# EAGLE board STM32-E407_Rev_E (EAGLE 4.16), part 1 of 2
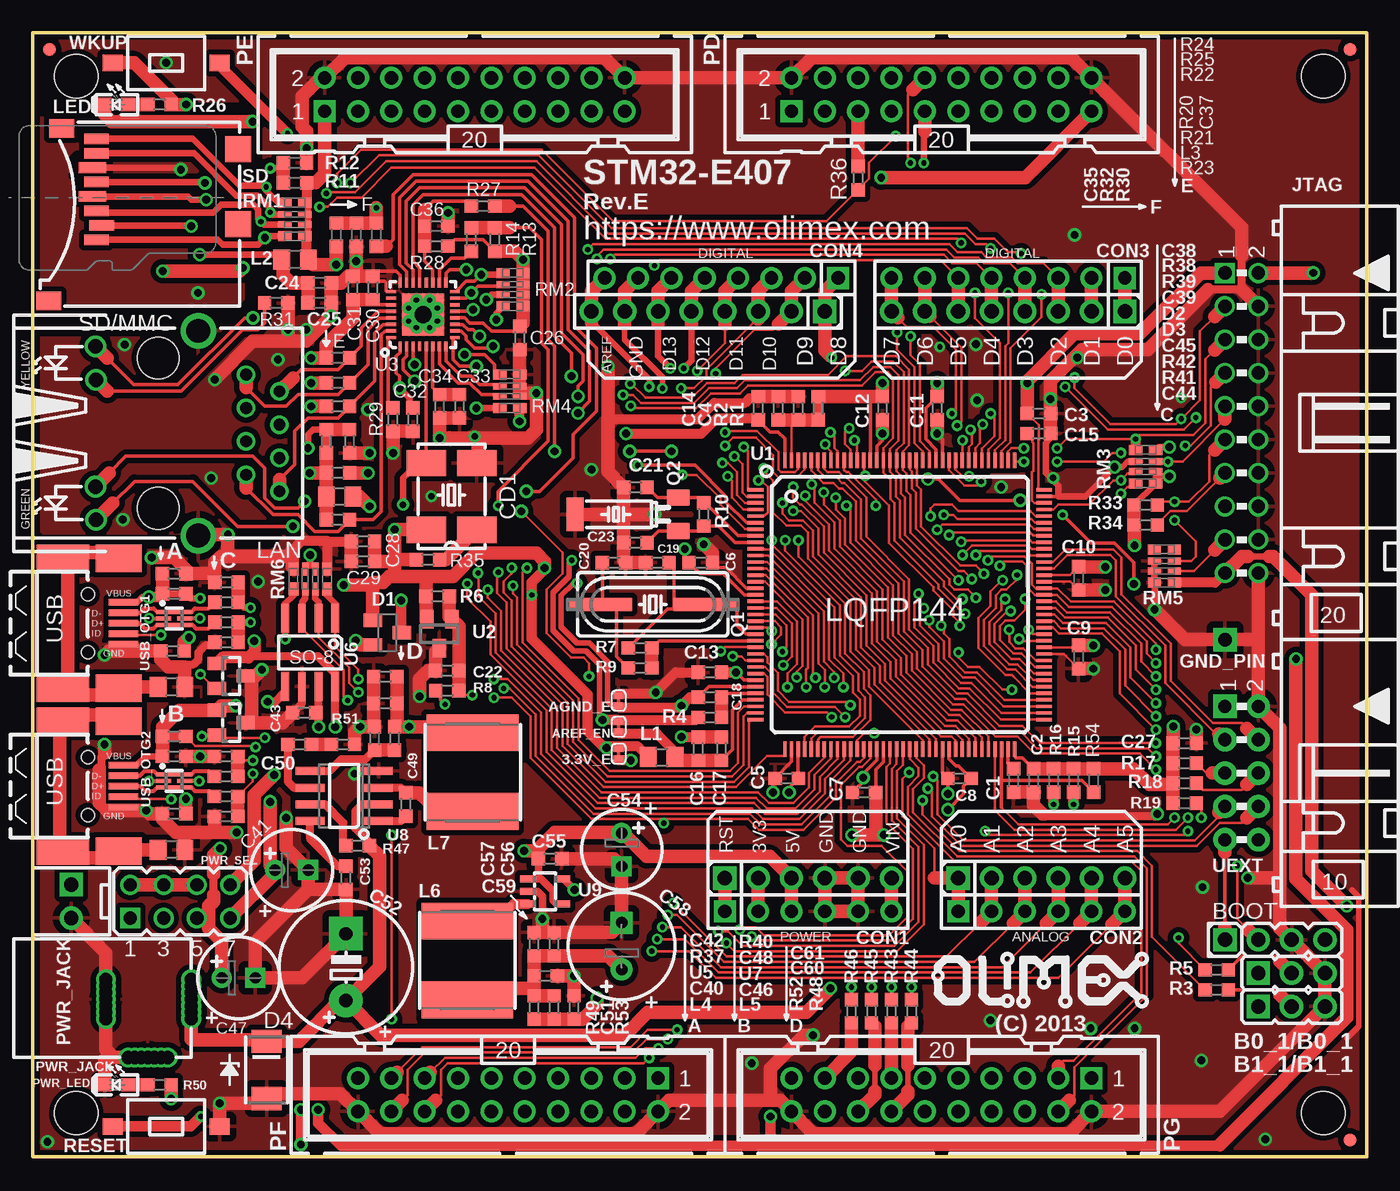
[diagram p2: board, top side]
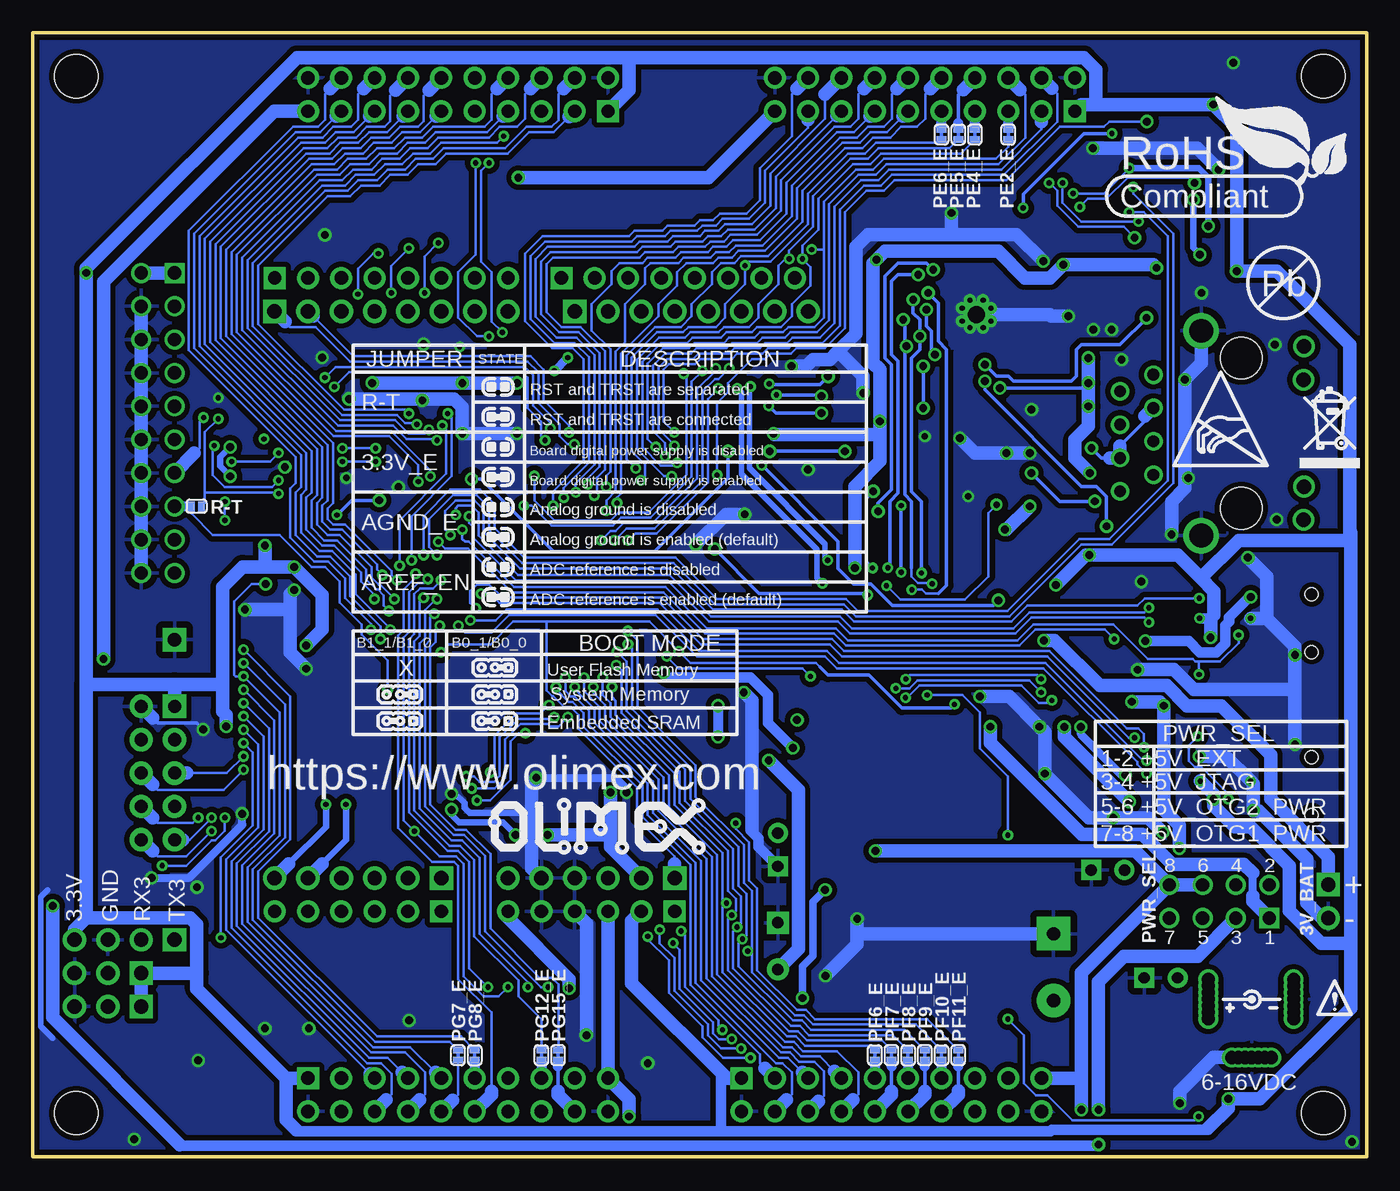
[diagram p3: board, bottom side, seen from below]

Size 101.6 x 85.6 mm. Coordinates in mm from the lower left corner, seen from the top.
Outline: 0,0 101.6,0 101.6,85.6 0,85.6 0,0
Copper layers (1+16): Top 0.035mm / dielectric 1.5mm / Bottom 0.035mm
Design rules "default": minimum track width 8mil, minimum drill 0.4mm, track to track 7.5mil, track to pad 7.5mil, pad to pad 7.5mil, via to via 7.5mil, smd to smd 1mil, copper to edge 10mil, drill to drill 8mil, minimum pad ring 10mil, minimum via ring 8mil, stop-mask expansion 4mil, vias tented up to drill 25mil, thermal gap 20mil
Net classes: 2 thin: width 0.025 mm, drill 0.025 mm; 3 gsm_pwr: width 0.914 mm, clearance 0.787 mm
Holes 3.3 mm at 3.3,82.3 98.3,82.3 98.3,3.3 3.3,3.3
tRestrict: 19 lines

## Footprints (pad centres in the part's own frame; a part is rotated, then mirrored left to right if it is on the bottom)
SJ_1_SMALLER_CLOSE = smd 0.508 x 0.762: 1 -0.381,0; 2 0.381,0
CON2.54MM-2-0 = drill 1.092 pad 1.778 square: 1 -1.27,0 | drill 1.092 pad 1.778 round: 2 1.27,0
JP2 = drill 1.1 pad 1.778 square: 1 -2.54,0 | drill 1.1 pad 1.778 round: 2 0,0; 3 2.54,0
HN1X4 = drill 1.1 pad 1.778 square: 1 -3.81,0 | drill 1.1 pad 1.778 round: 2 -1.27,0; 3 1.27,0; 4 3.81,0
C0603_DWS = smd 1.016 x 1.016: 1 -0.889,0; 2 0.889,0
E2,5-6,3 = drill 0.864 pad 1.524 round: + -1.27,0 | drill 0.864 pad 1.524 square: - 1.27,0
E5-10,5 = drill 1.016 pad 2.54 round: + -2.54,0 | drill 1.016 pad 2.54 square: - 2.54,0
E2,5-6 = drill 0.864 pad 1.524 round: + -1.27,0 | drill 0.864 pad 1.524 square: - 1.27,0
E3,5-8 = drill 0.864 pad 1.676 round: + -1.778,0 | drill 0.864 pad 1.676 square: - 1.778,0
7X5MM_CLOCK_DRIVER = smd 2 x 3: 1 -2.54,-1.941; 2 2.54,-1.941; 3 2.54,1.901; 4 -2.54,1.901
PN1X6 = drill 1.1 pad 1.778 square: 1 -6.35,0 | drill 1.1 pad 1.778 round: 2 -3.81,0; 3 -1.27,0; 4 1.27,0; 5 3.81,0; 6 6.35,0
PN1X8 = drill 1.1 pad 1.778 square: 1 -8.89,0 | drill 1.1 pad 1.778 round: 2 -6.35,0; 3 -3.81,0; 4 -1.27,0; 5 1.27,0; 6 3.81,0; 7 6.35,0; 8 8.89,0
SOT23C = smd 1 x 1.4: 1 -0.95,-1.1; 2 0.95,-1.1; 3 0,1.1
SOT-23 = smd 1 x 1.4: 1 -0.95,-1.1; 2 0.95,-1.1; 3 0,1.1
DO214AA = smd 1.778 x 2.286: A 2.177,0; C -2.177,0
TEST_PAD40/70/SQUARE = drill 1.016 pad 1.778 square: P$1 0,0
BH20R = drill 1.016 square: 1 -11.43,-1.27 | drill 1.016 round: 2 -11.43,1.27; 3 -8.89,-1.27; 4 -8.89,1.27; 5 -6.35,-1.27; 6 -6.35,1.27; 7 -3.81,-1.27; 8 -3.81,1.27; 9 -1.27,-1.27; 10 -1.27,1.27; 11 1.27,-1.27; 12 1.27,1.27; 13 3.81,-1.27; 14 3.81,1.27; 15 6.35,-1.27; 16 6.35,1.27; 17 8.89,-1.27; 18 8.89,1.27; 19 11.43,-1.27; 20 11.43,1.27
L0805_5MIL_DWS = smd 1.27 x 1.524: 1 -1.016,0; 2 1.016,0
L7078 = smd 2.8 x 7: 1 -3,0; 2 3,0
RJLBC-060TC1 = drill 0.9 round: 1 -4.455,6.7; 2 -3.185,9.24; 3 -1.915,6.7; 4 -0.645,9.24; 5 0.625,6.7; 6 1.895,9.24; 7 3.165,6.7; 8 4.435,9.24 | drill 1.1 round: AG 4.07,-4.773; AY -6.61,-4.773; KG 6.61,-4.748; KY -4.07,-4.748 | drill 1.8 round: GND1 -7.8,3.05; GND2 7.8,3.05 | hole 3.2: -5.715,0; 5.715,0
LED-0603 = smd 1.016 x 1.016: A 0.889,0; C -0.889,0
ML20-MALE = drill 1.016 pad 1.676 square: 1 -11.43,-1.27 | drill 1.016 pad 1.676 round: 2 -11.43,1.27; 3 -8.89,-1.27; 4 -8.89,1.27; 5 -6.35,-1.27; 6 -6.35,1.27; 7 -3.81,-1.27; 8 -3.81,1.27; 9 -1.27,-1.27; 10 -1.27,1.27; 11 1.27,-1.27; 12 1.27,1.27; 13 3.81,-1.27; 14 3.81,1.27; 15 6.35,-1.27; 16 6.35,1.27; 17 8.89,-1.27; 18 8.89,1.27; 19 11.43,-1.27; 20 11.43,1.27
PWR_JACK_UNI_MILLING = drill 1 round: + 0,4.75; +1 0,5.25; +2 0,5.75; +3 0,6.25; +4 0,4.25; +5 0,3.75; +6 0,3.25; - -6.5,4.75; -1 -6.5,5.25; -2 -6.5,5.75; -3 -6.5,4.25; -4 -6.5,3.75; -5 -6.5,6.25; -6 -6.5,3.25; -- -3.3,0.3; --1 -3.8,0.3; --2 -4.3,0.3; --3 -4.8,0.3; --4 -2.8,0.3; --5 -2.3,0.3; --6 -1.8,0.3
JP4Q_2 = drill 1 pad 1.524 square: 1 -3.81,-1.27 | drill 1 pad 1.524 round: 2 -3.81,1.27; 3 -1.27,-1.27; 4 -1.27,1.27; 5 1.27,-1.27; 6 1.27,1.27; 7 3.81,-1.27; 8 3.81,1.27
HC49/SMD2_THIN = smd 5 x 1: 1 -4.064,0; 2 4.064,0
TC26H_3_REPAIR_SMD = smd 1.27 x 1.778: 1 -1.27,0; 2 1.27,0 | smd 2.54 x 1.27: GND 0,7.874
0603_0R = smd 1.016 x 1.016: 1 -0.889,0; 2 0.889,0
R0603_5MIL_DWS = smd 1.016 x 1.016: 1 -0.889,0; 2 0.889,0
SJ_1_SMALLER = smd 0.508 x 0.762: 1 -0.381,0; 2 0.381,0
WS-TAKT_6X3.5_SMD_NOCREAM = smd 1.27 x 1.524: P$1 0,4.064; P$2 0,-4.064
R_MATRIX_4 = smd 1.016 x 0.762: 1.1 -0.762,1.27; 1.2 0.762,1.27; 4.1 -0.762,-1.27; 4.2 0.762,-1.27 | smd 1.016 x 0.508: 2.1 -0.762,0.381; 2.2 0.762,0.381; 3.1 -0.762,-0.381; 3.2 0.762,-0.381
TFR/C-MEM-CON = smd 0.8 x 1.9: 1 -3.2,10.9; 2 -2.1,10.5; 3 -1,10.9; 5 1.2,10.9; 7 3.4,10.9; 8 4.5,10.9 | smd 0.8 x 2.1: 4 0.1,11.2; 6 2.3,11.2 | smd 2 x 2: 9 3.7,0.1; 10 -2,0.1 | smd 1.4 x 1.9: 11 5.3,13.55; 12 -7.85,14.55
LQFP144 = smd 1.2 x 0.254: 1 -11,8.75; 2 -11,8.25; 3 -11,7.75; 4 -11,7.25; 5 -11,6.75; 6 -11,6.25; 7 -11,5.75; 8 -11,5.25; 9 -11,4.75; 10 -11,4.25; 11 -11,3.75; 12 -11,3.25; 13 -11,2.75; 14 -11,2.25; 15 -11,1.75; 16 -11,1.25; 17 -11,0.75; 18 -11,0.25; 19 -11,-0.25; 20 -11,-0.75; 21 -11,-1.25; 22 -11,-1.75; 23 -11,-2.25; 24 -11,-2.75; 25 -11,-3.25; 26 -11,-3.75; 27 -11,-4.25; 28 -11,-4.75; 29 -11,-5.25; 30 -11,-5.75; 31 -11,-6.25; 32 -11,-6.75; 33 -11,-7.25; 34 -11,-7.75; 35 -11,-8.25; 36 -11,-8.75; 73 11,-8.75; 74 11,-8.25; 75 11,-7.75; 76 11,-7.25; 77 11,-6.75; 78 11,-6.25; 79 11,-5.75; 80 11,-5.25; 81 11,-4.75; 82 11,-4.25; 83 11,-3.75; 84 11,-3.25; 85 11,-2.75; 86 11,-2.25; 87 11,-1.75; 88 11,-1.25; 89 11,-0.75; 90 11,-0.25; 91 11,0.25; 92 11,0.75; 93 11,1.25; 94 11,1.75; 95 11,2.25; 96 11,2.75; 97 11,3.25; 98 11,3.75; 99 11,4.25; 100 11,4.75; 101 11,5.25; 102 11,5.75; 103 11,6.25; 104 11,6.75; 105 11,7.25; 106 11,7.75; 107 11,8.25; 108 11,8.75 | smd 0.254 x 1.2: 37 -8.75,-11; 38 -8.25,-11; 39 -7.75,-11; 40 -7.25,-11; 41 -6.75,-11; 42 -6.25,-11; 43 -5.75,-11; 44 -5.25,-11; 45 -4.75,-11; 46 -4.25,-11; 47 -3.75,-11; 48 -3.25,-11; 49 -2.75,-11; 50 -2.25,-11; 51 -1.75,-11; 52 -1.25,-11; 53 -0.75,-11; 54 -0.25,-11; 55 0.25,-11; 56 0.75,-11; 57 1.25,-11; 58 1.75,-11; 59 2.25,-11; 60 2.75,-11; 61 3.25,-11; 62 3.75,-11; 63 4.25,-11; 64 4.75,-11; 65 5.25,-11; 66 5.75,-11; 67 6.25,-11; 68 6.75,-11; 69 7.25,-11; 70 7.75,-11; 71 8.25,-11; 72 8.75,-11; 109 8.75,11; 110 8.25,11; 111 7.75,11; 112 7.25,11; 113 6.75,11; 114 6.25,11; 115 5.75,11; 116 5.25,11; 117 4.75,11; 118 4.25,11; 119 3.75,11; 120 3.25,11; 121 2.75,11; 122 2.25,11; 123 1.75,11; 124 1.25,11; 125 0.75,11; 126 0.25,11; 127 -0.25,11; 128 -0.75,11; 129 -1.25,11; 130 -1.75,11; 131 -2.25,11; 132 -2.75,11; 133 -3.25,11; 134 -3.75,11; 135 -4.25,11; 136 -4.75,11; 137 -5.25,11; 138 -5.75,11; 139 -6.25,11; 140 -6.75,11; 141 -7.25,11; 142 -7.75,11; 143 -8.25,11; 144 -8.75,11
SOT23 = smd 1 x 1.4: 1 -0.95,-1.1; 2 0.95,-1.1; 3 0,1.1
QFN-32(DRILLS) = smd 0.25 x 0.75: 1 -1.75,-2.425; 2 -1.25,-2.425; 3 -0.75,-2.425; 4 -0.25,-2.425; 5 0.25,-2.425; 6 0.75,-2.425; 7 1.25,-2.425; 8 1.75,-2.425; 17 1.75,2.425; 18 1.25,2.425; 19 0.75,2.425; 20 0.25,2.425; 21 -0.25,2.425; 22 -0.75,2.425; 23 -1.25,2.425; 24 -1.75,2.425 | smd 0.75 x 0.25: 9 2.425,-1.75; 10 2.425,-1.25; 11 2.425,-0.75; 12 2.425,-0.25; 13 2.425,0.25; 14 2.425,0.75; 15 2.425,1.25; 16 2.425,1.75; 25 -2.425,1.75; 26 -2.425,1.25; 27 -2.425,0.75; 28 -2.425,0.25; 29 -2.425,-0.25; 30 -2.425,-0.75; 31 -2.425,-1.25; 32 -2.425,-1.75 | drill 1.3 round: EP1 0,0 | drill 0.4 round: EP2 -0.5,1.1; EP3 0.5,1.1; EP4 1.1,0.5; EP5 1.1,-0.5; EP6 0.5,-1; EP7 -0.5,-1; EP8 -1.1,-0.5; EP9 -1.1,0.5 | smd 3.2 x 3.2: EXP_PAD 0,0
ARDUINO_SHIELD_PLATFORM_WITHOUT_DIMENSION = drill 1.016 pad 1.676 round: 3V3 22.86,2.54; 5V 25.4,2.54; A1 40.64,2.54; A2 43.18,2.54; A3 45.72,2.54; A4 48.26,2.54; A5 50.8,2.54; AREF 11.176,50.8; D1 48.26,50.8; D2 45.72,50.8; D3 43.18,50.8; D4 40.64,50.8; D5 38.1,50.8; D6 35.56,50.8; D7 33.02,50.8; D9 26.416,50.8; D10 23.876,50.8; D11 21.336,50.8; D12 18.796,50.8; D13 16.256,50.8; GND 27.94,2.54; GND@1 30.48,2.54; GND@2 13.716,50.8; VIN 33.02,2.54 | drill 1.016 pad 1.676 square: A0 38.1,2.54; D0 50.8,50.8; D8 28.956,50.8; RST 20.32,2.54
USBLC6-2P6 = smd 0.3 x 1.46: 1 -0.5,-0.65; 3 0.5,-0.65; 4 0.5,0.65; 6 -0.5,0.65 | smd 0.3 x 1.16: 2 0,-0.8; 5 0,0.8
SO-8 = smd 0.6 x 2.2: 1 -1.905,-2.6; 2 -0.635,-2.6; 3 0.635,-2.6; 4 1.905,-2.6; 5 1.905,2.6; 6 0.635,2.6; 7 -0.635,2.6; 8 -1.905,2.6
SOIC8 = smd 0.6 x 2.2: 1 -1.905,-2.6; 2 -0.635,-2.6; 3 0.635,-2.6; 4 1.905,-2.6; 5 1.905,2.6; 6 0.635,2.6; 7 -0.635,2.6; 8 -1.905,2.6
SOT23-5 = smd 0.55 x 1.2: 1 -0.95,-1.3; 2 0,-1.3; 3 0.95,-1.3; 4 0.95,1.3; 5 -0.95,1.3
FIDUCIAL-1X2 = smd 1 x 1: 1 0,0
BH10R = drill 1 pad 1.778 square: 1 -5.08,-1.27 | drill 1 pad 1.778 round: 2 -5.08,1.27; 3 -2.54,-1.27; 4 -2.54,1.27; 5 0,-1.27; 6 0,1.27; 7 2.54,-1.27; 8 2.54,1.27; 9 5.08,-1.27; 10 5.08,1.27
USB_MINI_9PIN = smd 2.25 x 0.5: D+ 2.706,0; D- 2.706,0.8; GND 2.706,-1.6; ID 2.706,-0.8; VBUS 2.706,1.6 | smd 4 x 2.1: GND1 -1.9,4.95; GND3 -1.9,-4.95 | smd 3.5 x 2.1: GND2 2.35,4.95; GND4 2.35,-4.95 | hole 1: 0,2.2; 0,-2.2

## Placement (x,y rotation side)
3.3V_E  Close  [SJ_1_SMALLER_CLOSE]  44.63,30.68 90 top
3V_BAT  WF2S  [CON2.54MM-2-0]  2.92,19.43 270 top
AGND_E  Close  [SJ_1_SMALLER_CLOSE]  44.63,34.72 90 top
AREF_EN  Close  [SJ_1_SMALLER_CLOSE]  44.63,32.74 90 top
B0_1/B0_1  HN1x3(B0_1:Open;B0_0:Close)  [JP2]  95.89,13.97 0 top
B1_1/B1_1  HN1x3(B1_1:Open;B1_0:Close)  [JP2]  95.89,11.43 0 top
BOOT  HN1X4  [HN1X4]  94.61,16.51 0 top
C1  2.2uF/6.3V  [C0603_DWS]  74.7,28.65 90 top
C2  10uF/6.3V  [C0603_DWS]  76.23,28.65 90 top
C3  10uF/6.3V  [C0603_DWS]  76.63,56.59 180 top
C4  10uF/6.3V  [C0603_DWS]  56.77,57 270 top
C5  10uF/6.3V  [C0603_DWS]  57.43,28.8 0 top
C6  10uF/6.3V  [C0603_DWS]  50.88,45.24 180 top
C7  100nF  [C0603_DWS]  63.32,27.74 0 top
C8  100nF  [C0603_DWS]  70.59,28.8 0 top
C9  100nF  [C0603_DWS]  79.65,38.05 90 top
C10  100nF  [C0603_DWS]  79.65,44.04 90 top
C11  100nF  [C0603_DWS]  68.88,57 90 top
C12  100nF  [C0603_DWS]  64.72,57 90 top
C13  100nF  [C0603_DWS]  51.56,36.88 0 top
C14  100nF  [C0603_DWS]  55.24,57 270 top
C15  2.2uF/6.3V  [C0603_DWS]  76.63,55.07 180 top
C16  10uF/6.3V  [C0603_DWS]  50.67,31.06 90 top
C17  100nF  [C0603_DWS]  52.45,31.06 270 top
C18  100nF  [C0603_DWS]  51.56,34.98 0 top
C19  27pF  [C0603_DWS]  47.57,45.24 180 top
C20  27pF  [C0603_DWS]  44.27,45.24 0 top
C21  15pF  [C0603_DWS]  45.9,50.98 180 top
C22  100nF  [C0603_DWS]  31.57,37.01 0 top
C23  15pF  [C0603_DWS]  45.9,46.76 180 top
C24  22uF/6.3V  [C0603_DWS]  21.84,66.55 0 top
C25  22uF/6.3V  [C0603_DWS]  21.84,65.02 0 top
C26  100nF  [C0603_DWS]  37.08,62.36 90 top
C27  100nF  [C0603_DWS]  87.73,31.5 180 top
C28  22uF/6.3V  [C0603_DWS]  25.15,46.86 0 top
C29  22uF/6.3V  [C0603_DWS]  25.15,45.34 0 top
C30  22uF/6.3V  [C0603_DWS]  25.91,66.17 270 top
C31  100nF  [C0603_DWS]  24.38,66.17 270 top
C32  100nF  [C0603_DWS]  28.96,56.13 90 top
C33  2.2uF/6.3V  [C0603_DWS]  32.51,57.15 90 top
C34  100nF  [C0603_DWS]  30.99,57.15 90 top
C35  100nF  [C0603_DWS]  23.11,70.21 270 top
C36  10uF/6.3V  [C0603_DWS]  30.73,70.87 180 top
C37  100nF  [C0603_DWS]  24.13,54.48 90 top
C38  47pF(NA)  [C0603_DWS]  14.76,43.74 180 top
C39  47pF(NA)  [C0603_DWS]  14.76,39.17 180 top
C40  100nF  [C0603_DWS]  10.64,38.51 0 top
C41  100uF/16V/LOWESR/105C/6.3x11mm_RM2.5  [E2,5-6,3]  19.71,21.82 0 top
C42  100nF  [C0603_DWS]  10.77,44.4 0 top
C43  100nF  [C0603_DWS]  20.68,33.81 180 top
C44  47pF(NA)  [C0603_DWS]  14.73,25.91 180 top
C45  47pF(NA)  [C0603_DWS]  14.73,30.48 180 top
C46  100nF  [C0603_DWS]  10.77,26.11 0 top
C47  100uF/16V/LOWESR/105C/6.3x11mm_RM2.5  [E2,5-6,3]  15.67,13.61 0 top
C48  100nF  [C0603_DWS]  10.77,30.48 0 top
C49  10nF  [C0603_DWS]  28.42,26.82 90 top
C50  3.3nF  [C0603_DWS]  20.32,31.39 0 top
C51  22pF  [C0603_DWS]  39.7,11.35 270 top
C52  470uF/25V/LOWESR/105C  [E5-10,5]  23.85,14.43 90 top
C53  100nF  [C0603_DWS]  23.85,21.23 270 top
C54  100uF/16V/mini  [E2,5-6]  44.86,23.37 270 top
C55  22uF/6.3V  [C0603_DWS]  39.4,22.68 0 top
C56  22uF/6.3V  [C0603_DWS]  39.7,16.18 90 top
C57  22uF/6.3V  [C0603_DWS]  38.18,16.18 90 top
C58  220uF/16V/mini  [E3,5-8]  44.86,16.03 90 top
C59  100nF  [C0603_DWS]  39.07,13.77 0 top
C60  22uF/6.3V  [C0603_DWS]  26.85,34.52 180 top
C61  22uF/6.3V  [C0603_DWS]  26.85,36.55 180 top
CD1  6NC2-50MHz  [7X5MM_CLOCK_DRIVER]  31.88,50.29 90 top
CON1  NA(PN1X6)  [PN1X6]  59.05,21.21 0 top
CON2  NA(PN1X6)  [PN1X6]  76.83,21.21 0 top
CON3  NA(PN1X8)  [PN1X8]  74.3,64.39 180 top
CON4  NA(PN1X8)  [PN1X8]  51.44,64.39 180 top
D1  BAT54C  [SOT23C]  27,39.9 270 top
D2  NA(ESDA6V1L)  [SOT-23]  15.11,36.6 270 top
D3  NA(ESDA6V1L)  [SOT-23]  15.11,33.05 270 top
D4  SMBJ16A  [DO214AA]  17.8,6.6 270 top
GND_PIN  TESTPAD3  [TEST_PAD40/70/SQUARE]  90.81,39.37 0 top
JTAG  BH20R  [BH20R]  92.08,55.88 270 top
L1  FB0805/600R/200mA(201209-601)  [L0805_5MIL_DWS]  47.9,30.43 0 top
L2  CL470nH/0805/1.76R/250mA  [L0805_5MIL_DWS]  19.96,68.33 180 top
L3  FB0805/600R/200mA(201209-601)  [L0805_5MIL_DWS]  23.37,50.29 0 top
L4  FB0805/600R/200mA(201209-601)  [L0805_5MIL_DWS]  10.57,35.76 180 top
L5  FB0805/600R/200mA(201209-601)  [L0805_5MIL_DWS]  10.57,23.37 180 top
L6  2.2uH/3A/YS75/7x8  [L7078]  33.1,14.94 270 top
L7  10uH/2.3A/YS75/7x8  [L7078]  33.5,29.29 90 top
LAN  RJLBC-060TC1  [RJLBC-060TC1]  9.55,55.1 270 top
LED  LED/GREEN/0603  [LED-0603]  6.35,80.14 0 top
PD  NA(BH20S)  [ML20-MALE]  69.22,80.9 0 top
PE  NA(BH20S)  [ML20-MALE]  33.66,80.9 0 top
PE2_E  Close  [SJ_1_SMALLER_CLOSE]  27.3,77.85 90 bottom
PE4_E  Close  [SJ_1_SMALLER_CLOSE]  29.84,77.85 90 bottom
PE5_E  Close  [SJ_1_SMALLER_CLOSE]  31.11,77.85 270 bottom
PE6_E  Close  [SJ_1_SMALLER_CLOSE]  32.38,77.85 90 bottom
PF  NA(BH20S)  [ML20-MALE]  36.2,4.7 180 top
PF6_E  Close  [SJ_1_SMALLER_CLOSE]  37.47,7.72 270 bottom
PF7_E  Close  [SJ_1_SMALLER_CLOSE]  36.2,7.72 90 bottom
PF8_E  Close  [SJ_1_SMALLER_CLOSE]  34.92,7.72 270 bottom
PF9_E  Close  [SJ_1_SMALLER_CLOSE]  33.66,7.72 90 bottom
PF10_E  Close  [SJ_1_SMALLER_CLOSE]  32.38,7.72 270 bottom
PF11_E  Close  [SJ_1_SMALLER_CLOSE]  31.11,7.72 90 bottom
PG  NA(BH20S)  [ML20-MALE]  69.22,4.7 180 top
PG7_E  Close  [SJ_1_SMALLER_CLOSE]  69.22,7.72 90 bottom
PG8_E  Close  [SJ_1_SMALLER_CLOSE]  67.94,7.72 270 bottom
PG12_E  Close  [SJ_1_SMALLER_CLOSE]  62.87,7.72 270 bottom
PG15_E  Close  [SJ_1_SMALLER_CLOSE]  61.59,7.72 90 bottom
PWR_JACK  YDJ-1136  [PWR_JACK_UNI_MILLING]  12.06,7.24 0 top
PWR_LED  LED/RED/0603  [LED-0603]  6.35,5.46 0 top
PWR_SEL  HN2x4(1-2:Close)  [JP4Q_2]  11.23,19.43 0 top
Q1  Q12.000MHz/HC-49SM(SMD)/20pF  [HC49/SMD2_THIN]  47.22,42.06 0 top
Q2  32768Hz/6pF  [TC26H_3_REPAIR_SMD]  49.17,48.92 90 top
R1  0R(board_mounted)  [0603_0R]  59.82,57 90 top
R2  NA  [R0603_5MIL_DWS]  58.29,57 90 top
R3  4.7k  [R0603_5MIL_DWS]  90.17,12.7 0 top
R4  22R  [R0603_5MIL_DWS]  51.56,33.45 0 top
R5  4.7k  [R0603_5MIL_DWS]  90.17,14.22 0 top
R6  10k  [R0603_5MIL_DWS]  30.84,42.67 180 top
R7  NA  [R0603_5MIL_DWS]  46.25,38.73 180 top
R8  1k  [R0603_5MIL_DWS]  31.57,35.48 0 top
R9  150R  [R0603_5MIL_DWS]  46.25,37.21 0 top
R10  NA  [R0603_5MIL_DWS]  51.1,48.92 90 top
R11  NA  [R0603_5MIL_DWS]  19.96,74.17 180 top
R12  1M  [R0603_5MIL_DWS]  19.96,75.69 0 top
R13  2.2k  [R0603_5MIL_DWS]  35.18,69.85 270 top
R14  150R  [R0603_5MIL_DWS]  33.4,69.85 270 top
R15  NA(10k)  [R0603_5MIL_DWS]  79.27,28.65 90 top
R16  NA(10k)  [R0603_5MIL_DWS]  77.75,28.65 90 top
R17  4.7k  [R0603_5MIL_DWS]  87.73,29.97 180 top
R18  4.7k  [R0603_5MIL_DWS]  87.73,28.45 180 top
R19  47k  [R0603_5MIL_DWS]  87.73,26.92 180 top
R20  0R(board_mounted)  [0603_0R]  22.35,54.48 270 top
R21  549R/1%  [R0603_5MIL_DWS]  23.24,52.07 0 top
R22  49.9R/1%  [R0603_5MIL_DWS]  23.24,57.15 180 top
R23  49.9R/1%  [R0603_5MIL_DWS]  23.24,48.51 180 top
R24  49.9R/1%  [R0603_5MIL_DWS]  23.24,60.83 180 top
R25  49.9R/1%  [R0603_5MIL_DWS]  23.24,58.93 180 top
R26  1k  [R0603_5MIL_DWS]  9.65,80.14 0 top
R27  NA  [R0603_5MIL_DWS]  34.29,72.39 180 top
R28  10k  [R0603_5MIL_DWS]  30.73,69.34 180 top
R29  12.1k/1%  [R0603_5MIL_DWS]  27.43,56.13 90 top
R30  1k  [R0603_5MIL_DWS]  26.16,70.21 270 top
R31  549R/1%  [R0603_5MIL_DWS]  18.54,65.02 0 top
R32  47k  [R0603_5MIL_DWS]  24.64,70.21 90 top
R33  NA  [R0603_5MIL_DWS]  84.76,49.63 180 top
R34  NA  [R0603_5MIL_DWS]  84.76,48.11 180 top
R35  47k  [R0603_5MIL_DWS]  30.1,45.47 0 top
R36  NA  [R0603_5MIL_DWS]  62.87,74.52 270 top
R37  0R(board_mounted)  [0603_0R]  10.77,42.88 180 top
R38  22R  [R0603_5MIL_DWS]  14.76,42.21 180 top
R39  22R  [R0603_5MIL_DWS]  14.76,40.69 180 top
R40  0R(board_mounted)  [0603_0R]  10.77,32 180 top
R41  22R  [R0603_5MIL_DWS]  14.73,27.43 180 top
R42  22R  [R0603_5MIL_DWS]  14.73,28.96 180 top
R43  NA  [R0603_5MIL_DWS]  65.41,11.07 90 top
R44  NA  [R0603_5MIL_DWS]  66.93,11.07 270 top
R45  NA  [R0603_5MIL_DWS]  63.88,11.07 270 top
R46  NA  [R0603_5MIL_DWS]  62.36,11.07 90 top
R47  47k  [R0603_5MIL_DWS]  24.74,23.67 180 top
R48  4.99k/1%  [R0603_5MIL_DWS]  27.56,31.85 90 top
R49  4.99k/1%  [R0603_5MIL_DWS]  38.18,11.35 270 top
R50  1k  [R0603_5MIL_DWS]  9.65,5.46 180 top
R51  2.2k  [R0603_5MIL_DWS]  23.62,31.39 0 top
R52  1.1k/1%  [R0603_5MIL_DWS]  26.04,31.85 90 top
R53  1.1k/1%  [R0603_5MIL_DWS]  41.22,11.35 90 top
R54  47k  [R0603_5MIL_DWS]  80.8,28.65 90 top
R-T  Open  [SJ_1_SMALLER]  89.13,49.53 180 bottom
RESET  T1107A(6X3,8X2,5MM)  [WS-TAKT_6X3.5_SMD_NOCREAM]  10.16,2.29 90 top
RM1  RA1206_(4X0603)_4B8_33k  [R_MATRIX_4]  19.96,71.37 0 top
RM2  RA1206_(4X0603)_4B8_4.7k  [R_MATRIX_4]  36.58,66.04 180 top
RM3  NA(10k)  [R_MATRIX_4]  84.76,52.55 0 top
RM4  RA1206_(4X0603)_4B8_4.7k  [R_MATRIX_4]  36.32,58.29 0 top
RM5  RA1206_(4X0603)_4B8_10k  [R_MATRIX_4]  86.18,44.98 180 top
RM6  RA1206_(4X0603)_4B8_33k  [R_MATRIX_4]  21.13,43.99 90 top
SD/MMC  MICRO  [TFR/C-MEM-CON]  15.75,73.03 90 top
U1  STM32F407ZET6  [LQFP144]  66.04,42.04 0 top
U2  NA  [SOT23]  30.96,39.83 180 top
U3  LAN8710A-EZC  [QFN-32(DRILLS)]  29.72,64.14 0 top
U4  NA(2xPN1x6_2xPN1x8)  [ARDUINO_SHIELD_PLATFORM_WITHOUT_DIMENSION]  32.38,16.13 0 top
U5  NA(USBLC6-2P6)  [USBLC6-2P6]  10.77,41 270 top
U6  MIC2026-1YM  [SO-8]  21.13,38.4 180 top
U7  NA(USBLC6-2P6)  [USBLC6-2P6]  10.77,28.6 270 top
U8  MP1482DS  [SOIC8]  23.72,27.46 90 top
U9  SY8008C(AA)C  [SOT23-5]  39.01,20.19 270 top
U$1  FIDUCIAL1X2  [FIDUCIAL-1X2]  1.27,84.33 0 top
U$2  FIDUCIAL1X2  [FIDUCIAL-1X2]  100.33,84.33 0 top
U$3  FIDUCIAL1X2  [FIDUCIAL-1X2]  100.33,1.27 0 top
U$4  [OLIMEX1_V]  49.2,22.89 0 bottom
U$5  [ESD_SYMBOL]  14.68,52.63 0 bottom
U$6  [PB]  6.35,66.55 0 bottom
U$7  [OLIMEX1_V]  86.16,11.18 0 top
U$8  [RECYCLE_BIN1/8]  5.11,52.45 0 bottom
U$15  [ROHS]  18.8,72.26 0 bottom
U$16  [ATTENTION_SMALL]  3.71,10.85 0 bottom
UEXT  BH10R  [BH10R]  92.08,29.21 270 top
USB_OTG1  USB-OTG  [USB_MINI_9PIN]  4.19,40.61 0 top
USB_OTG2  USB-OTG  [USB_MINI_9PIN]  4.19,28.22 0 top
WKUP  T1107A(6X3,8X2,5MM)  [WS-TAKT_6X3.5_SMD_NOCREAM]  10.16,83.31 90 top

## Tracks (layer width: path | path; a pad name or v marks a point on that pad's centre or on a via)
+5V  (via drill 0.6)
  Top 0.559: U9.4 39.89,19.24 39.62,19.51 39.62,20.22 38.7,21.14 38.51,21.14 | 38.51,21.14 U9.1 | C55.1 38.51,21.14
  Top 0.61: 21.77,33.81 U6.7 | v21.77,32.72 21.77,33.81 | 21.77,33.81 C43.1
  Top 0.813: 90.4,0.91 90.3,0.81 56.19,0.81 | 56.19,0.81 23.47,0.81 21.74,2.54 v21.74,3.56 | 56.19,0.81 v56.19,3.05
  Top 1.016: U4.5V CON1.3 56.13,22.86 46.76,22.86 44.93,24.69 44.81,24.69 | 44.81,24.69 C54.+ | PWR_SEL.2 PWR_SEL.4 PWR_SEL.6 | PWR_SEL.8 16.87,22.53 16.87,27.53 v18.39,29.06 | v37.41,23.29 38.51,23.29 38.51,23.27 | 38.51,23.27 C55.1 | v64.62,74.57 75.59,74.57 PD.19 | v96.22,37.9 96.22,21.13 100.08,17.27 100.08,10.59 90.4,0.91 | 44.81,24.69 39.73,24.69 38.51,23.47 38.51,23.27
  Bottom 0.61: v18.39,29.06 18.67,29.06 21.77,32.16 v21.77,32.72
  Bottom 1.016: U4.5V PG.19 56.19,4.37 v56.19,3.05 | PWR_SEL.8 PWR_SEL.6 | v37.41,23.29 17.63,23.29 PWR_SEL.8 | 21.74,5.97 PF.19 | 21.74,5.97 21.74,13.99 PWR_SEL.8 | v64.62,74.57 50.14,74.57 PE.19 | PD.19 83.24,79.63 96.22,66.65 v96.22,37.9 | v21.74,3.56 21.74,5.97
+5V_EXT  (via drill 0.6)
  Top 1.016: C61.1 C60.1 27.74,32.74 | 27.74,32.74 R48.2 | 27.74,32.74 v28.65,32.74 33.05,32.74 L7.2
  Bottom 0.61: 8.69,19.86 8.69,21.59
  Bottom 1.016: PWR_SEL.1 8.69,19.43 8.69,19.86 | 8.69,21.59 9.35,22.25 14.81,22.25 17.09,24.54 21.69,24.54 28.65,31.5 v28.65,32.74
+5V_JTAG  (via drill 0.6)
  Top 0.508: 94.18,45.72 92.56,45.72
  Top 0.762: RM5.1.1 90.07,43.71 JTAG.19
  Top 0.813: v20.42,0.91 v20.42,3.56
  Top 1.016: JTAG.19 92.08,45.72 92.56,45.72 | 94.18,45.72 94.49,45.72 97.43,42.77 97.43,21.74 v100.08,19.1
  Bottom 0.813: 90.4,0.91 90.3,0.81 20.52,0.81 v20.42,0.91
  Bottom 1.016: PWR_SEL.3 12.88,15.24 18.49,15.24 20.42,13.31 v20.42,3.56 | v100.08,19.1 100.08,10.59 90.4,0.91
+5V_OTG1_PWR  (via drill 0.6)
  Top 0.508: USB_OTG1.VBUS 7.92,42.22 8.33,42.62 v8.84,42.62 | R37.2 C42.1
  Top 0.61: v23.04,32.72 U6.8 23.04,36.8 21.74,38.1 16.87,38.1 v16.87,39.27
  Top 0.813: R37.2 9.63,42.62 v8.84,42.62
  Top 0.914: v16.87,39.27 16.89,39.27 16.89,38.46 16.43,38 14.46,38 D2.1
  Top 1.016: R37.2 C42.1 | PWR_SEL.7 18.44,21.57 C41.+ 18.09,22.17 v18.09,27.03
  Bottom 0.813: v16.87,39.27 13.56,39.27 12.7,38.41 11.46,38.41 10.77,39.09 10.77,40.44 10.46,40.74 10.46,41.05 10.52,41 10.52,41.05 8.94,42.62 v8.84,42.62
  Bottom 1.016: v18.09,27.03 23.04,31.98 v23.04,32.72
+5V_OTG2_PWR  (via drill 0.6)
  Top 0.508: USB_OTG2.VBUS 7.92,29.82 8.59,30.48 C48.1
  Top 0.61: v17.88,34.65 18.44,34.65 19.23,35.43 U6.5 | 13.77,19.91 13.77,21.49
  Top 1.016: C48.1 R40.2 9.88,32.74 11.13,33.99 D3.1 14.36,34.34 v15.44,34.34 | C47.+ 14.4,16.38 13.41,17.37 13.41,18.16 | 13.41,18.16 PWR_SEL.5 | 13.41,18.16 13.41,19.07 13.77,19.43 13.77,19.91 | 13.77,21.49 13.77,22.96 v14.28,23.47
  Bottom 1.016: v17.88,34.65 15.75,34.65 v15.44,34.34 15.44,26.39 14.28,25.22 v14.28,23.47
+7V
  Top 0.254: C17.2 53.29,31.01 53.29,34.01 54.07,34.79 U1.33
  Top 0.508: AREF_EN.1 44.63,32.23
  Top 0.762: 44.63,32.23 47.52,32.23 48.92,30.84 L1.2
  Top 1.016: C17.2 C16.1 49.17,30.18 L1.2
+15V  (via drill 0.6)
  Top 0.61: U8.2 25.09,26.82 24.59,26.31 24.59,24.99 25.63,23.95 R47.1
  Top 1.016: U4.VIN CON1.6 | v60.76,12.8 58.93,10.97 46.84,10.97 45.11,9.25 26.49,9.25 C52.+ | R47.1 26.42,22.89 26.42,14.45 C52.+ | PWR_JACK.+ 12.06,8.94 12.1,8.91 12.1,8.9 17.68,8.9 D4.C 20.28,8.78 23.39,11.89 C52.+
  Bottom 1.016: v60.76,12.8 60.76,13.51 65.41,18.16 U4.VIN
AGND  (via drill 0.4, 0.6)
  Top 0.254: U1.31 53.22,35.79 53.19,35.81 51.51,35.81 C18.1
  Top 0.406: v41.45,43.66 41.17,43.66 40.23,42.72 40.23,40.34 41.45,39.12 42.39,39.12 43.79,37.72 43.79,34.67 44.07,34.39 44.63,34.39 AGND_E.1 | v47.95,58.52 47.95,59.36 45.09,62.23 45.09,63.4
  Top 0.508: AGND_E.1 44.63,34.21
  Top 0.762: 44.63,34.21 49.28,34.21 v49.4,34.34 50.04,34.98 C18.1 | v49.4,31.95 C16.2
  Top 1.016: U4.GND@2 45.09,65.91 CON4.7 45.09,63.4 | C16.2 C17.1
  Bottom 0.406: v47.95,58.52 47.62,58.19 47.62,51.99 41.86,46.23 41.86,44.07 v41.45,43.66
  Bottom 0.762: v49.4,34.34 v49.4,31.95
AREF  (via drill 0.4, 0.6)
  Top 0.406: v41.05,45.41 40.84,45.21 40.84,44.2 39.62,42.98 39.62,40.08 41.2,38.51 42.14,38.51 43.18,37.47 43.18,33.45 v43.38,33.25 | 42.55,63.52 42.65,63.52 46.99,59.18 46.99,58.7 v46.94,58.65
  Top 0.508: AREF_EN.2 44.63,33.25
  Top 0.762: R4.1 50.47,33.25 44.63,33.25 v43.38,33.25
  Top 1.016: U4.AREF 42.55,65.91 CON4.8 42.55,63.52
  Bottom 0.406: v46.94,58.65 47.02,58.57 47.02,52.43 41.25,46.66 41.25,45.62 v41.05,45.41
BOOT0  (via drill 0.4)
  Top 0.203: U1.138 60.29,52.36 60.53,52.12 61.39,52.12 61.8,51.71 61.98,51.71 63.5,50.19 63.5,47.22 66.75,43.97 66.75,40.16 68.17,38.73 68.17,37.47 70.38,35.26 71.2,35.26 73.64,32.82 75.39,32.82 76.7,31.51 85.54,31.51 v85.55,31.5 | R5.1 87.27,16.23 v87.27,16.66
  Bottom 0.203: v85.55,31.5 84.84,30.79 84.84,25.22 87.27,22.78 v87.27,16.66
GND  (via drill 0.4, 0.5, 0.6)
  Top 0.203: U1.94 79.02,43.79 C10.1 | U1.83 78.53,38.29 C9.1
  Top 0.254: 78.13,50.29 U1.107 | U1.130 64.29,54.1 64.72,54.53 v64.72,55.07 | U1.51 64.29,30.2 63.25,29.16 v63.25,28.85 63.25,28.55 C7.1 | v69.7,27.64 C8.1 69.29,29.21 U1.61 | U1.38 57.79,30.08 56.52,28.8 C5.1 56.39,28.65 v56.39,27.74 | U1.120 69.29,54.66 v68.89,55.07 | C6.1 52.15,44.86 52.78,44.86 54.35,43.29 U1.16 | U3.24 27.97,67.16 27.69,67.44 25.91,67.44 C30.1 25.91,66.67 26.8,66.67 26.92,66.55 26.92,65.91 26.95,65.89 U3.25
  Top 0.305: v8.84,41 U5.2 | v8.84,28.6 U7.2
  Top 0.406: 82.91,52.53 82.98,52.53 83.39,52.93 83.46,52.93 | 100.48,20.3 101.02,19.76 101.02,9.93 100.08,8.99
  Top 0.508: 7.82,26.62 USB_OTG2.GND | RM5.3.2 RM5.2.2 RM5.1.2 85.45,43.69 v85.45,41.66 | SD/MMC.6 11.14,75.33 v11.28,75.18 | 82.91,52.53 v82.4,52.53 80.16,50.29 78.13,50.29 78.13,51.1 77.17,52.07 77.17,54.36 77.52,54.71 C15.1 | 83.46,52.93 RM3.2.1 | 44.63,35.23 AGND_E.2 | 7.82,26.62 | 7.82,26.36 7.82,26.62 | 6.9,38.51 USB_OTG1.GND | 37.08,58.17 RM4.3.2
  Top 0.559: U9.2 38.43,20.19 38.81,19.81 v38.81,18.11
  Top 0.61: U6.6 20.5,34.52 C43.2 | v24.51,29.16 24.71,29.36 U8.4 | 89.51,66.04 92.08,66.04 92.08,68.63 | 5.05,29.46 5.26,29.67 5.26,30.56 5.46,30.76 5.49,30.79 | C39.2 13.66,38.96 13.18,38.96 12.62,38.41 12.62,37.87 12.24,37.49 11.58,37.49 11.58,37.41 | 76.89,26.11 77.09,25.91 85.45,25.91 v85.65,26.11
  Top 0.762: C14.1 55.12,57.76 54.59,57.76 54.23,57.4 51.89,57.4 50.65,56.16 43.81,56.16 | C13.1 48.97,36.88 v47.45,35.36 47.32,35.23 44.63,35.23 | 19.74,44.96 19.66,44.96 RM6.1.2 | 5.05,26.95 5.05,26.77 5.46,26.36 5.64,26.36 | 22.4,46.91 20.47,46.91 19.74,46.18 | 22.4,46.91 RM6.4.2 | 11.58,37.29 11.58,37.41 | 22.4,46.91 22.45,46.86 C28.1
  Top 0.813: 59.28,1.93 59.28,1.83 79.05,1.83 79.15,1.93 | 26.26,1.93 26.36,1.83 46.02,1.83 46.13,1.93
  Top 1.016: 13.87,44.4 C42.2 11.66,44.73 10.77,45.62 v9.04,45.62 | R2.2 C4.1 C14.1 | v64.72,55.07 C12.1 | v68.89,55.07 C11.1 | R12.2 v20.85,76.81 20.85,78.11 20.52,78.44 20.52,80.77 21.92,82.17 PE.2 23.77,83.72 43.54,83.72 PE.20 PD.2 59.33,83.72 79.1,83.72 PD.20 92.08,70.74 92.08,68.63 | C61.2 C60.2 25.96,32.74 R52.2 v24.92,32.74 24.51,32.33 R51.2 | 16.38,33.05 D3.3 | 16.38,36.6 D2.3 | 16.38,36.6 16.66,36.32 16.66,33.05 16.38,33.05 | 38.81,17.07 C56.2 44.12,17.07 C58.- C54.- 44.27,22.68 C55.2 | U2.3 30.68,38.45 C22.1 30.1,37.01 29.46,36.37 v29.46,35.05 | C15.1 C3.1 v77.52,57.71 77.52,59.08 79.91,61.47 84.94,61.47 89.51,66.04 | 95,21.23 95,17.4 BOOT.3 B0_1/B0_1.3 B1_1/B1_1.3 90.42,3.43 PG.2 79.15,1.93 | 95,21.23 95,32.64 UEXT.2 93.34,39.37 | 93.34,39.37 JTAG.20 | 93.34,39.37 GND_PIN.P$1 87.73,39.37 v85.45,41.66 | v81.69,43.16 C10.1 | v88.62,32.54 C27.1 | 59.28,1.93 PG.20 56.95,4.27 56.19,4.27 | 56.19,4.27 48.46,4.27 PF.2 46.13,1.93 | 26.26,1.93 PF.20 23.42,4.78 18.07,4.78 17.8,4.5 D4.A 17.8,4.4 17.46,4.06 v14.22,4.06 RESET.P$2 | v80.77,37.16 C9.1 | JTAG.4 92.08,66.04 | 24.64,67.06 v24.64,68.2 R32.1 | PWR_JACK.-- 6.18,7.54 5.89,7.82 | 5.89,7.82 5.57,8.15 PWR_JACK.- 5.57,15.52 3V_BAT.2 | PWR_LED.C 5.46,7.39 5.89,7.82 | C19.2 C20.2 45.01,45.39 C23.2 45.01,48.92 | 45.01,48.92 Q2.GND | 45.01,48.92 C21.2 43.81,52.17 43.81,56.16 v43.81,60.2 | 16.38,33.05 19.02,33.05 C43.2 | v5.46,38.2 5.77,38.51 6.9,38.51 C40.1 9.75,37.85 10.31,37.29 11.58,37.29 L4.1 | 13.84,24.69 C44.2 | 11.58,24.69 10.87,24.69 9.88,25.68 C46.1 8.89,26.11 v8.64,26.36 7.82,26.36 5.64,26.36 | C45.2 v12.75,30.48 C48.2 | 13.87,44.4 13.87,45.24 14.35,45.72 14.86,45.72
  Top 1.016: 14.86,45.72 19.74,45.72 19.74,44.96 19.74,46.18 | 13.87,44.4 C38.2 | 38.81,17.07 C57.2 | 5.05,26.95 5.05,29.46 | 5.46,30.76 v5.46,31.39 | 20.98,20.34 C53.2 C52.- 20.5,13.61 C47.- 16.94,16.31 20.98,20.34 | 20.98,20.34 C41.- 19.3,23.5 v19.3,25.81 | C6.1 51.77,45.97 v51.1,46.63 | 45.01,48.92 v47.37,48.92 | 14.86,45.72 v14.86,47.37 12.67,47.37 LAN.GND2 | 11.58,24.69 13.84,24.69 | 13.84,24.69 v15.52,24.69 | 11.58,24.69 L5.1 | 76.89,26.11 76.22,26.77 C2.1 C1.1 | 95,21.23 v92.56,21.23 | 16.38,36.6 16.97,36.6 v17.45,37.08 | v59.44,9.25 58.73,9.25 56.19,6.71 56.19,4.27 | C59.2 v41.22,13.77 R53.2 | v38.81,18.11 38.81,17.07 | 24.64,67.06 C31.1 24,67.06 23.5,66.55 C24.2 C25.2 v22.73,64.01 20.83,62.1 19.43,62.1 | 24.64,67.06 C30.1 | 19.43,62.1 16.76,62.1 v13.84,59.18 | 19.43,62.1 v19.43,62.99 R31.2 | v25.65,53.59 C37.1 | v27.43,53.59 R29.1 C32.1 | C33.1 C34.1 v30.99,54.74 33.91,54.74 | C26.1 RM4.1.2 RM4.2.2 37.08,58.17 v38.35,58.17 38.35,55.37 37.72,54.74 33.91,54.74 | CD1.2 33.91,52.92 33.91,54.74 | C28.1 C29.1 | v31.62,71.88 C36.1 | U4.GND CON1.4 CON1.5 U4.GND@1 U4.GND
  Bottom 0.254: 92.46,33.4 92.08,33.02 89.1,33.02 v88.62,32.54
  Bottom 0.406: 100.08,8.99 101.02,9.93 101.02,19.76 100.48,20.3
  Bottom 0.508: v69.7,27.64 69.42,27.64 68.71,26.92 68.71,26.54 68.33,26.16 63.6,26.16
  Bottom 0.61: v56.39,27.74 56.39,28.02 57.23,28.85 v63.25,28.85 | v85.65,26.11 85.65,25.27 89.69,21.23 v92.56,21.23
  Bottom 0.813: 46.84,24.89 46.84,24.74 46.33,24.23 46.33,23.57 C54.-
  Bottom 1.016: v64.72,55.07 v68.89,55.07 68.89,57.1 69.49,57.71 v77.52,57.71 | JTAG.4 JTAG.6 JTAG.8 JTAG.10 JTAG.12 JTAG.14 JTAG.16 JTAG.18 JTAG.20 | CON1.5 63.6,21.95 63.6,26.16 63.6,28.5 v63.25,28.85 | v85.45,41.66 81.99,41.66 | 81.99,41.66 81.99,41.55 | UEXT.2 92.46,33.4 | v80.77,37.16 81.99,38.38 81.99,41.66 | 40.26,61.34 38.91,62.69 38.91,69.29 37.97,70.23 31.62,70.23 | 40.26,61.34 40.89,60.71 42.16,60.71 42.67,60.2 v43.81,60.2 | v29.46,35.05 27.23,35.05 v24.92,32.74 24.51,32.33 v24.51,29.16 21.16,25.81 v19.3,25.81 16.64,25.81 v15.52,24.69 | 7.62,41 5.46,38.84 v5.46,38.2 5.46,35.56 | v20.85,76.81 12.9,76.81 v11.28,75.18 | v12.75,30.48 10.72,30.48 v8.84,28.6 8.64,28.4 v8.64,26.36 8.64,26.31 8.23,26.31 4.57,22.66 4.57,19.3 3.43,18.16 3V_BAT.2 | v5.46,31.39 5.46,35.56 | 5.46,35.56 13.18,35.56 14.71,37.08 v17.45,37.08 | v51.1,46.63 48.82,48.92 v47.37,48.92 | 46.84,24.89 46.84,34.75 v47.45,35.36 | v14.86,47.37 14.86,49.91 13.84,50.93 v13.84,59.18 12.6,60.43 LAN.GND1 | PWR_JACK.-- 11.66,7.54 14.22,4.98 v14.22,4.06 | v9.04,45.62 7.62,44.2 7.62,41 | 7.62,41 v8.84,41 | U4.GND 59.44,17.78 v59.44,9.25 | C52.- 38.81,16.97 | 38.81,16.97 v38.81,18.11 | 38.81,16.97 38.81,16.18 v41.22,13.77 | v24.64,68.2 26.67,70.23 31.62,70.23 | v22.73,64.01 24,64.01 24.13,64.14 U3.EP1 | v25.65,53.59 v27.43,53.59 29.84,53.59 v30.99,54.74 | 40.26,61.34 38.35,59.44 v38.35,58.17 | v81.69,43.16 81.99,42.85 81.99,41.66 | 31.62,70.23 v31.62,71.88
  other vias: 10.16,83.31 79.35,70.21 73.76,51 80.57,9.75 89,7.32 54.76,7.11 72.95,10.36 89.1,20.52 1.12,1.12 79.55,60.86 71.93,57.61 71.83,61.87 69.09,61.67 83.92,9.75 17.17,43.79 93.88,1.32 87.47,57.8 25.53,56.9 18.67,60.71 42.55,52.32 13.59,51.69 6.86,48.51 12.57,65.79 6.99,61.85 77.72,51.69 33.66,54.86 30.35,50.29 20.83,62.99
  pour Bottom (isolate 0.406, rank 4): -15.24,88.9 111.76,88.9 111.76,-2.54 -15.24,-2.54
  pour Top (isolate 0.406, rank 4): -17.78,91.44 119.38,91.44 119.38,-5.08 -17.78,-5.08
  pour Bottom (no thermals): 27.3,66.67 27.3,61.59 31.75,61.59 31.75,66.67
LED  (via drill 0.4, 0.6)
  Top 0.203: U1.7 54.24,47.79 52.38,49.66 52.38,50.11 50.57,51.92 v49.48,51.92
  Top 1.016: LED.C 5.46,79.38 5.99,78.84 v16.74,78.84
  Bottom 0.203: v49.48,51.92 49.48,57.4 48.67,58.22 48.67,58.93 46.84,60.76 45.82,60.76 45.41,61.16 43.84,61.16 43.43,61.57 41.25,61.57 39.73,63.09 39.73,71.93 38.1,73.56 36.78,73.56 35.97,74.37 27.43,74.37 23.37,78.44 20.02,78.44 19.61,78.84 v16.74,78.84
N$1
  Top 0.254: U1.23 54.32,39.79 53.65,40.46 53.65,41.66 53.24,42.06 Q1.2 48.84,42.06 | 48.84,42.06 48.84,44.86 C19.1 | R7.2 48.34,41.71 48.84,41.71 48.84,42.06
N$2
  Top 0.254: R9.1 44.48,38.1 44.48,41.68 44.09,42.06 43.38,42.06 | 43.38,42.06 Q1.1 | 43.38,42.06 C20.1
N$3
  Top 0.254: U1.24 47.69,39.29 R7.1
  Top 1.016: R9.2 R7.1
N$4
  Top 0.203: RM5.2.1 88.42,44.6 90.02,46.2
  Top 1.016: 90.02,46.2 JTAG.17
N$5
  Top 1.016: LED.A R26.1
N$6
  Top 1.016: R36.1 PD.5
N$8  (via drill 0.6)
  Top 0.559: U9.5 40.43,21.14 v41.25,20.32
  Top 1.016: R53.1 R49.2 C51.2 41.86,10.46 42.98,11.58 v42.98,12.06
  Bottom 0.559: v42.98,12.06 42.98,14.5 42.19,15.29 42.19,19.38 v41.25,20.32
N$9
  Top 0.254: R5.2 92.08,15.24 94.61,15.24 95,14.86
  Top 1.016: 95,14.86 B0_1/B0_1.2
N$10  (via drill 0.6)
  Top 0.508: 44.63,30.18 3.3V_E.1
  Top 0.762: v45.54,30.18 44.63,30.18
  Top 1.016: 38.18,12.8 R49.1 C51.1 | 38.18,12.8 C59.1 C57.1 C56.1 43.81,15.29 C58.+ | L6.2 33.96,12.8 38.18,12.8
  Bottom 1.016: v45.54,30.18 43.28,27.91 43.28,15.82 C58.+
N$12
  Top 0.406: 66.67,4.98 66.67,6.96
  Top 1.016: PG.14 66.67,4.7 66.67,4.98 | R44.2 66.67,9.93 66.67,6.96
N$13
  Bottom 0.508: PF10_E.2 32.38,7.21
  Bottom 0.762: 32.38,7.21 PF.13
N$14
  Top 0.406: 64.14,4.98 64.14,6.96
  Top 1.016: PG.16 64.14,4.7 64.14,4.98 | R45.2 64.14,9.93 64.14,6.96
N$15
  Bottom 0.508: PF6_E.2 37.47,7.21
  Bottom 0.762: 37.47,7.21 PF.9
N$16
  Bottom 0.508: PF8_E.2 34.92,7.21
  Bottom 0.762: 34.92,7.21 PF.11
N$17
  Bottom 0.254: 36.2,4.98 36.2,6.86
  Bottom 0.508: 36.2,7.21 PF7_E.1
  Bottom 0.762: 36.2,6.86 36.2,7.21
  Bottom 1.016: PF.10 36.2,4.7 36.2,4.98
N$18
  Top 1.016: PG.17 62.36,8 R46.1
N$19
  Bottom 0.254: 33.66,4.98 33.66,6.86
  Bottom 0.508: 33.66,7.21 PF9_E.1
  Bottom 0.762: 33.66,6.86 33.66,7.21
  Bottom 1.016: PF.12 33.66,4.7 33.66,4.98
N$24
  Bottom 0.203: 69.62,4.29 69.22,4.7 PG7_E.1
  Bottom 1.016: PG.10 69.62,4.29
N$25  (via drill 0.4)
  Top 0.813: v19.41,77.93 14.58,82.75 14.58,82.96 WKUP.P$2
  Top 1.016: 24.74,71.09 C35.1 | R32.2 24.74,71.09 | 24.74,71.09 R30.1 v26.16,72.26
  Bottom 0.254: v19.41,77.93 21.54,77.93 26.16,73.3 v26.16,72.26
N$26
  Bottom 0.254: 30.73,81.28 31.11,80.9 31.11,78.74
  Bottom 0.508: PE5_E.1 31.11,78.36
  Bottom 0.762: 31.11,78.36 31.11,78.74
  Bottom 1.016: 30.73,81.28 PE.8
N$27
  Bottom 0.508: PE6_E.2 32.38,78.36
  Bottom 0.762: 32.38,78.36 PE.9
N$28
  Bottom 0.508: PE4_E.2 29.84,78.36
  Bottom 0.762: 29.84,78.36 PE.7
N$29
  Top 0.254: R3.2 94.61,12.7 95,12.32
  Top 1.016: 95,12.32 B1_1/B1_1.2
N$30
  Bottom 0.508: PE2_E.2 27.3,78.36
  Bottom 0.762: 27.3,78.36 PE.5
N$31
  Top 0.254: U3.19 30.47,67.58 29.84,68.2 R28.2 | 29.84,72.14 30.48,72.77 33.02,72.77 R27.2
  Top 1.016: R28.2 C36.2 29.84,72.14
N$32
  Bottom 0.508: PG8_E.2 67.94,7.09
  Bottom 0.762: 67.94,7.09 PG.11
N$34
  Bottom 0.508: PG12_E.2 62.87,7.21
  Bottom 0.762: 62.87,7.21 PG.15
N$35
  Bottom 0.254: 61.59,4.98 61.59,6.86
  Bottom 0.508: 61.59,7.21 PG15_E.1
  Bottom 0.762: 61.59,6.86 61.59,7.21
  Bottom 1.016: PG.18 61.59,4.7 61.59,4.98
N$36
  Top 0.61: U8.8 21.12,24.19 23.19,22.12 C53.1
N$37
  Top 0.61: U8.7 22.25,26.82 23.65,25.43 23.65,23.88 R47.2
N$38
  Top 1.016: PG.13 R43.1
N$39
  Bottom 0.254: 31.11,5 31.11,6.86
  Bottom 0.508: 31.11,7.21 PF11_E.1
  Bottom 0.762: 31.11,6.86 31.11,7.21
  Bottom 1.016: PF.14 31.11,4.7 31.11,5
N$41
  Top 0.254: U3.29 26.42,63.88 25.53,62.99 25.53,60.33 R25.1 23.24,58.04 20.19,58.04 19.3,57.15 17.65,57.15 16.25,58.56
  Top 1.016: 16.25,58.56 LAN.1
N$42
  Top 0.254: U3.28 26.29,64.39 25.02,63.12 25.02,61.72 R24.1 23.24,59.94 20.45,59.94 19.81,59.31 | LAN.2
  Top 1.016: LAN.2 19.81,59.31
N$43
  Top 0.305: U7.4 12.08,28.1 12.34,27.84 13.44,27.84 R41.2
N$44
  Top 0.254: U3.31 26.82,62.88 26.54,62.61 26.54,49.15 25.91,48.51 R23.1 23.24,47.62 21.46,47.62 20.19,48.9 18.29,48.9 16.25,50.94
  Top 1.016: LAN.7 16.25,50.94
N$46
  Top 0.61: U8.1 28.04,25.55 C49.1
N$47
  Top 0.305: U7.6 12.08,29.1 12.34,29.36 13.41,29.36 13.82,28.96 R42.2
N$49
  Top 0.254: U3.30 26.68,63.38 26.04,62.74 26.04,59.05 R22.1 23.24,56.26 20.95,56.26 19.94,55.24 | 19.94,55.24 19.94,54.36 | 19.94,55.24 19.94,52.7 18.79,51.55
  Top 1.016: LAN.8 18.79,51.55
N$50
  Top 0.61: U8.3 28.04,28.09 C49.2
  Top 1.016: C49.2 29.44,27.71 30.02,27.13 31.6,27.13 31.93,26.8 32.99,26.8 L7.1
N$51
  Top 0.305: U5.6 12.08,41.5 12.34,41.76 13.41,41.76 R38.2
N$52
  Top 0.305: U5.4 12.16,40.5 12.42,40.23 13.41,40.23 R39.2
N$53  (via drill 0.6)
  Top 0.254: U3.2 28.47,60.98 28.19,60.71 28.19,59.94 v29.08,59.05 | 6.09,49.78 7.74,51.44 12.19,51.44 15.62,48.01 v19.81,48.01
  Top 1.016: LAN.KG 6.09,49.78
  Bottom 0.254: v29.08,59.05 29.08,58.42 21.72,51.05 20.57,51.05 19.81,50.29 v19.81,48.01
N$54  (via drill 0.6)
  Top 0.254: v29.08,60.33 28.97,60.44 U3.3 | v16.76,63.88 16.13,63.88 11.05,58.8 7.68,58.8 5.65,60.83
  Top 1.016: LAN.AY 5.65,60.83
  Bottom 0.254: v29.08,60.33 28.19,59.44 27.3,59.44 26.92,59.05 22.48,59.05 22.1,59.44 22.1,61.47 21.72,61.85 18.8,61.85 v16.76,63.88
N$55
  Top 0.254: R29.2 27.05,57.4 27.05,62.38 U3.32 27.3,62.38
N$56  (via drill 0.6)
  Top 0.508: v20.95,53.98 20.95,54.99 21.34,55.37 R20.1
  Top 1.016: R20.1 C37.2
  Bottom 0.254: 19.55,53.21 19.56,53.21 20.19,53.21 v20.95,53.98 | 18.79,54.11 16.89,56.01 16.89,56.39 | 16.26,57.02 LAN.3
  Bottom 1.016: 19.55,53.21 LAN.6 18.79,54.11 | 16.89,56.39 16.26,57.02
N$57
  Top 0.254: R31.1 17.65,63.5 17.14,62.99 16,62.99 11.3,58.29 5.68,58.29
  Top 1.016: LAN.KY 5.68,58.29
N$58
  Top 0.254: U3.6 30.47,58.56 C34.2
  Top 1.016: C33.2 C34.2
N$59  (via drill 0.6)
  Top 0.254: U3.27 26.29,64.9 C30.2 | U3.1 27.97,61.24 27.69,60.96 27.69,59.69 27.94,59.44 v27.94,58.55
  Top 0.508: C32.2 28.7,57.28 28.7,57.78 v27.94,58.55
  Top 1.016: R23.2 L3.1 R21.1 | R21.1 v21.08,52.07 | R21.1 R20.2 | C30.2 C31.2 24.38,63.88 22.35,61.85 R24.2 v21.21,60.83 | v21.21,58.93 R25.2 | v21.21,57.15 R22.2
  Bottom 0.254: 21.21,58.55 v27.94,58.55
  Bottom 1.016: v21.21,60.83 v21.21,58.93 21.21,58.55 v21.21,57.15 21.21,55.63 22.23,54.61 22.23,53.21 v21.08,52.07
N$60
  Top 0.61: U8.6 19.89,28.09 19.43,28.55 C50.1
N$61
  Top 1.016: R51.1 C50.2
N$62
  Top 0.61: U8.5 22.61,29.36 23.52,30.28 25.35,30.28 R52.1
  Top 1.016: R52.1 R48.1
N$63
  Top 0.254: U3.18 30.97,67.54 31.88,68.45 32.89,68.45 R14.2
N$64
  Top 0.762: U9.3 36.62,19.24 35.31,17.93 L6.1
N$65  (via drill 0.6)
  Top 0.254: 5.81,52.07 7.08,53.34 16.76,53.34 17.65,52.45 17.65,50.16 18.41,49.4 20.19,49.4 v20.7,49.91
  Top 1.016: v25.53,52.07 R21.2 | LAN.AG 5.81,52.07
  Bottom 0.254: v25.53,52.07 23.37,49.91 v20.7,49.91
N$75  (via drill 0.6)
  Top 1.016: v24.59,39.32 24.95,38.95 D1.2
  Bottom 1.016: 3V_BAT.1 2.92,22.84 7.32,27.23 7.32,30.58 11.07,34.34 13.69,34.34 15.21,35.87 20.32,35.87 23.77,39.32 v24.59,39.32
N$78  (via drill 0.6)
  Top 0.508: v12.7,68.71 18.95,68.71 L2.2 | SD/MMC.4 11.84,73.12 12.06,72.9 v13.21,72.9
  Top 1.016: C25.1 C24.1 19.68,66.55 19.07,67.16 19.07,68.2 L2.2
  Bottom 0.508: v13.21,72.9 13.21,69.22 v12.7,68.71
N$85  (via drill 0.4)
  Top 0.203: 90.02,53.82 89.61,53.42 89.61,51.44 88.06,49.89 v86.97,49.89 85.9,49.89 R33.1 | RM5.3.1 88.24,45.36 88.59,45.72 88.59,46.84 v86.97,48.46
  Top 1.016: 90.02,53.82 JTAG.11
  Bottom 0.203: v86.97,48.46 v86.97,49.89
N$117
  Top 0.254: C1.2 74.29,29.95 U1.71
N$119
  Top 1.016: CD1.1 33.78,47.75 31.5,45.47 R35.2
N$128
  Top 0.203: U1.106 76.3,49.79 76.1,49.99 76.1,52.12 76.2,52.22 76.2,54.36 76.15,54.41 76.15,54.66 C15.2
N$129
  Top 1.016: PWR_LED.A R50.2
N$163  (via drill 0.4)
  Top 0.203: v33.48,35.15 32.79,35.15 R8.2 | v27.33,10.46 v27.33,24.49
  Top 0.813: RESET.P$1 12.04,2.29 v12.8,3.05
  Top 1.016: R6.1 31.73,41.12 U2.1 32.46,40.38 C22.2 R8.2
  Bottom 0.203: v27.33,24.49 27.33,28.96 29.46,31.09 29.46,33.83 30.79,35.15 v33.48,35.15 | v27.33,10.46 26.11,9.25 26.11,5.59 25.2,4.67 24.33,4.67 22.4,2.74 13.11,2.74 v12.8,3.05
N$470
  Top 0.203: U1.143 57.79,56.11
  Top 1.016: C4.2 57.79,56.11 R2.1 R1.1
PA0/WKUP  (via drill 0.4, 0.6)
  Top 0.203: U1.34 54.17,34.29 53.72,33.83 53.72,30 53.09,29.36 43.92,29.36 41.55,31.73 41.55,34.9 37.29,39.17 37.29,44.48 v37.64,44.83
  Top 0.254: v37.59,50.67 38.61,50.67 41.15,53.21 41.15,54.99 42.93,56.77 42.93,61.59 41.27,63.25 41.27,71.5 37.97,74.8 28.96,74.8 27.43,73.28 27.43,69.85 26.92,69.34
  Top 1.016: R30.2 26.19,69.34 26.92,69.34
  Bottom 0.254: v37.59,50.67 38.1,50.16 38.1,45.29 v37.64,44.83
PA1/D8/ETH_RMII_REF_CLK  (via drill 0.4, 0.5)
  Top 0.203: U1.35 54.39,33.79 54.13,33.53 54.13,29.84 53.24,28.96 43.76,28.96 41.15,31.57 41.15,34.75 36.88,39.01 36.88,42.57 36.58,42.88 v36.58,43.48
  Top 0.254: U3.5 CD1.3 | CD1.3 | 29.34,52.83 29.97,52.83 CD1.3
  Top 0.508: 29.34,52.83 28.19,51.69 v28.19,49.66
  Bottom 0.203: v36.58,43.48 35.51,42.42 30.61,42.42 28.83,44.2 28.83,49.02 v28.19,49.66
PA2/ETH_RMII_MDIO  (via drill 0.4, 0.6)
  Top 0.203: U1.36 54.6,33.29 54.53,33.22 54.53,29.69 53.39,28.55 43.61,28.55 40.74,31.42 40.74,34.59 36.47,38.86 36.47,42.37 35.87,42.98 35.87,43.79 36.47,44.4 v36.47,44.86
  Top 0.254: U3.16 32.23,65.89 33.02,66.67 33.66,66.67 v34.16,67.18
  Top 0.508: RM2.4.2 35.81,67.18 v34.16,67.18
  Bottom 0.254: v34.16,67.18 35.69,67.18 36.2,66.67 36.2,61.09 35.69,60.58 35.69,50.55 36.32,49.91 36.32,45.01 v36.47,44.86
PA3/ETH_RMII_MDINT  (via drill 0.4)
  Top 0.203: U1.37 57.29,30.67 57.15,30.53 55.93,30.53 53.54,28.14 43.46,28.14 40.34,31.27 40.34,34.44 36.07,38.71 36.07,42.22 35.36,42.93 35.36,44.4 v35.46,44.5
  Top 0.254: 36.32,70.74 37.85,70.74 38.73,69.85 38.73,61.98 39.24,61.47 39.24,54.48 35.43,50.67 35.43,49.58 v35.46,49.58
  Top 1.016: R14.1 R13.1 36.32,70.74
  Bottom 0.254: v35.46,44.5 v35.46,49.58
PA4/D10/SPI1_NSS  (via drill 0.4)
  Top 0.203: U1.40 58.79,31.97 59.59,32.77 62.18,32.77 62.99,33.58 62.99,34.82 62.48,35.33 62.48,36.6 61.06,38.02 61.06,41.83 56.29,46.61 v56.29,46.94 | v49.38,58.52 50.37,58.52 51.31,59.46 51.31,59.94 55.17,63.8 55.24,63.8
  Top 1.016: U4.D10 55.24,65.91 CON4.3 55.24,63.8
  Bottom 0.203: v56.29,46.94 56.19,46.94 55.68,47.45 54.08,47.45 50.19,51.33 50.19,57.71 v49.38,58.52
PA5/D13/SPI1_SCK  (via drill 0.4)
  Top 0.203: U1.41 59.29,31.86 59.79,32.36 62.33,32.36 63.4,33.43 63.4,34.98 62.89,35.48 62.89,36.75 61.47,38.18 61.47,41.99 57.3,46.15 v57.3,46.94
  Top 0.508: v48.56,60.05 47.62,60.98 47.62,63.4
  Top 1.016: U4.D13 47.62,65.91 CON4.6 47.62,63.4
  Bottom 0.203: v57.3,46.94 56.39,47.85 54.23,47.85 50.6,51.49 50.6,58.29 49.66,59.23 49.38,59.23 v48.56,60.05
PA6/D12/SPI1_MISO  (via drill 0.4)
  Top 0.203: U1.42 59.79,31.75 59.99,31.95 62.48,31.95 63.8,33.27 63.8,35.13 63.3,35.64 63.3,36.91 61.87,38.33 61.87,42.14 58.32,45.7 v58.32,46.94
  Top 0.508: v49.58,60.05 50.16,60.63 50.16,63.4
  Top 1.016: U4.D12 50.16,65.91 CON4.5 50.16,63.4
  Bottom 0.203: v58.32,46.94 57.61,47.65 57.2,47.65 56.59,48.26 54.38,48.26 51,51.64 51,58.45 49.58,59.87 v49.58,60.05
PA7/D11/ETH_RMII_CRS_DV  (via drill 0.4, 0.6)
  Top 0.203: U1.43 60.29,30.39 59.13,29.23 59.13,28.12 57.94,26.92 56.06,26.92 55.24,27.74 43.31,27.74 39.93,31.11 39.93,34.29 35.66,38.56 35.66,41.55 34.65,42.57 v34.65,43.18
  Top 0.254: U3.15 33,65.39 v33.4,65.79 33.91,66.29 35.69,66.29 RM2.3.2
  Bottom 0.203: v34.65,43.18 33.88,43.18 33.58,42.88 32.64,42.88
  Bottom 0.254: v33.4,65.79 32.64,65.02 32.64,62.1 32,61.47 32,43.51 32.64,42.88
PA8/USB_HS_VBUSON  (via drill 0.4)
  Top 0.203: U1.100 76.15,46.79 76,46.94 70.81,46.94 v70.71,46.84
  Top 0.508: 19.23,42.04 19.23,42.11 19.86,42.75 RM6.1.1 | v19.23,39.42 U6.4
  Top 0.61: U6.4 19.23,42.04
  Bottom 0.203: v70.71,46.84 70.21,46.33 68.45,46.33 65.1,42.98 53.54,42.98 50.39,39.83 40.56,39.83 39.65,38.91 26.47,38.91 25.25,40.13 19.94,40.13 v19.23,39.42
PA9/OTG_FS_VBUS  (via drill 0.4)
  Top 0.203: U1.101 76.21,47.29 75.95,47.55 70,47.55 v69.8,47.35
  Top 0.508: R37.1 12.01,42.52 v12.75,42.52
  Bottom 0.203: v69.8,47.35 70.21,47.75 70.21,49.17 69.39,49.99 67.94,49.99 67.26,49.3 67.26,47.57 64.49,44.81 52.93,44.81 49.78,41.66 39.95,41.66 39.04,40.74 27.08,40.74 25.86,41.96 17.48,41.96 16.92,42.52 v12.75,42.52
PA10/OTG1_FS_ID  (via drill 0.4)
  Top 0.203: USB_OTG1.ID 6.99,39.73 v9.75,39.73 | U1.102 76.27,47.79 75.89,48.16 69.29,48.16 v68.89,47.75 | v12.78,36.73 13.85,35.65 D2.2
  Bottom 0.203: v68.89,47.75 68.89,47.04 68.68,46.84 68.4,46.84 64.95,43.38 53.39,43.38 50.24,40.23 40.41,40.23 39.5,39.32 26.62,39.32 25.4,40.54 19.3,40.54 16.66,37.9 13.26,37.9 13.06,37.69 12.78,37.69 | 12.78,37.69 11.18,37.69 9.75,39.12 v9.75,39.73 | 12.78,37.69 v12.78,36.73
PA11/OTG_FS_DM  (via drill 0.4)
  Top 0.203: U1.103 76.33,48.29 76.05,48.56 70.41,48.56 70.1,48.87 v69.39,48.87
  Top 0.508: R38.1 16.05,41.81 v16.59,41.81
  Top 1.016: R38.1 C38.1
  Bottom 0.203: v16.59,41.81 16.94,41.45 25.7,41.45 26.92,40.23 39.19,40.23 40.11,41.15 49.94,41.15 53.09,44.3 64.64,44.3 67.67,47.32 67.67,49.07 68.17,49.58 69.19,49.58 69.39,49.38 v69.39,48.87
PA12/OTG_FS_DP  (via drill 0.4)
  Top 0.203: v68.38,48.77 68.38,49.38 68.68,49.68 70,49.68 70.51,49.17 76,49.17 76.4,48.77 77.06,48.77 U1.104
  Top 0.508: R39.1 v16.59,40.69
  Top 1.016: C39.1 R39.1
  Bottom 0.203: v68.38,48.77 68.38,48.26 68.07,47.95 68.07,47.17 64.8,43.89 53.24,43.89 50.09,40.74 40.26,40.74 39.34,39.83 26.77,39.83 25.55,41.05 16.94,41.05 v16.59,40.69
PA13/TMS  (via drill 0.4)
  Top 0.203: 90.12,59 89.71,58.6 89.71,55.68 88.19,54.15 v87.78,54.15 | RM3.3.1 83.84,52.02 83.39,52.02 v82.88,51.51 82.3,51.51 80.44,49.66 78.11,49.66 77.72,49.28 77.05,49.28 U1.105
  Top 1.016: 90.12,59 JTAG.7
  Bottom 0.203: v82.88,51.51 83.39,51 86.97,51 87.88,51.92 87.88,54.05 v87.78,54.15
PA14/TCK  (via drill 0.4)
  Top 0.203: 90.81,56.16 87.58,52.93 v86.46,52.93 | U1.109 74.79,52.93 v75.49,52.93 | v78.03,52.93 81.58,52.93 82.25,53.59 v82.88,53.59
  Top 0.508: v86.46,52.93 RM3.2.2
  Top 1.016: 90.81,56.16 JTAG.9
  Bottom 0.203: v75.49,52.93 v78.03,52.93 | v82.88,53.59 83.54,52.93 v86.46,52.93
PA15/TDI  (via drill 0.4)
  Top 0.203: v84,54.66 RM3.1.1 | v84,54.66 84.3,54.97 88.39,54.97 89.31,55.88 89.31,60.73 90.02,61.44 | U1.110 74.29,53.69 74.55,53.95 v75.49,53.95 | v78.03,53.95 78.74,54.66 v84,54.66
  Top 0.762: v84,54.66 RM3.1.1
  Top 1.016: 90.02,61.44 JTAG.5
  Bottom 0.203: v75.49,53.95 v78.03,53.95
PB0/USB_FS_VBUSON  (via drill 0.4)
  Top 0.203: U1.46 61.79,30.22 60.35,28.78 60.35,27.66 58.4,25.7 55.6,25.7 54.79,26.52 42.85,26.52 38.71,30.66 38.71,33.83 36.17,36.37 v35.1,36.37 | v24.79,36.37 24.79,37.08 23.04,38.84 U6.1
  Top 0.508: 23.04,42.04 23.04,42.11 22.4,42.75 RM6.4.1
  Top 0.61: U6.1 23.04,42.04
  Bottom 0.203: v24.79,36.37 25.09,36.68 34.8,36.68 v35.1,36.37
PB1/USB_FS_FAULT  (via drill 0.4)
  Top 0.203: U1.47 62.29,30.16 60.76,28.63 60.76,27.51 58.55,25.3 55.45,25.3 54.63,26.11 42.7,26.11 38.3,30.5 38.3,33.68 36.32,35.66 v35.87,35.66 | v24.79,35.36 24.08,36.07 24.08,37.24 21.77,39.55 U6.2
  Top 0.508: U6.2 21.77,42.24 21.51,42.49 RM6.3.1
  Bottom 0.203: v35.87,35.66 34.82,35.66 34.21,36.27 25.7,36.27 v24.79,35.36
PB2  (via drill 0.4)
  Top 0.203: U1.48 62.79,31.7 63.32,32.23 v64.08,32.23 | v67.77,27.13 67.77,26.06 70.56,23.27 84.12,23.27 85.24,22.15 85.24,16.74 R3.1
  Bottom 0.203: v64.08,32.23 64.62,32.23 65.23,31.62 65.23,28.68 66.78,27.13 v67.77,27.13
PB3/TDO  (via drill 0.4)
  Top 0.203: U1.133 62.79,54.35 v62.59,54.56 | 90.42,51.69 87.91,49.17 86.64,49.17 85.65,48.18 R34.1 | v78.64,58.62 81.89,55.37 87.68,55.37 v88.59,56.29
  Top 1.016: JTAG.13 90.42,51.69
  Bottom 0.203: v62.59,54.56 62.89,54.86 62.89,55.98 63.91,57 63.91,59.33 64.31,59.74 77.52,59.74 v78.64,58.62 | v88.59,56.29 88.9,55.98 88.9,53.98 89.31,53.57
  Bottom 1.016: 89.31,53.57 JTAG.13
PB4/TRST  (via drill 0.4)
  Top 0.203: U1.134 62.29,53.86 61.87,54.28 61.87,55.17 v62.18,55.47 | v82.88,50.49 83.39,51 83.72,51 RM3.4.1 | v79.35,59.33 79.35,58.52 82.09,55.78 87.07,55.78 v87.48,56.19 88.9,57.61 88.9,62.87 90.02,63.98
  Top 1.016: 90.02,63.98 JTAG.3
  Bottom 0.203: v62.18,55.47 62.18,55.88 63.5,57.2 63.5,59.54 64.11,60.15 78.54,60.15 v79.35,59.33 | 88.49,50.6 82.98,50.6 v82.88,50.49 | 88.49,50.6 88.49,49.78 R-T.1 | v87.48,56.19 88.49,55.17 88.49,50.6
PB5/D11/SPI1_MOSI  (via drill 0.4)
  Top 0.203: v64.21,49.58 64.21,50.04 62.13,52.12 61.98,52.12 61.79,52.31 U1.135 | v50.6,59.84 52.7,61.95 52.7,63.4
  Top 1.016: U4.D11 52.7,65.91 CON4.4 52.7,63.4
  Bottom 0.203: v64.21,49.58 63.6,49.58 62.08,48.06 57.4,48.06 56.79,48.67 54.53,48.67 51.41,51.79 51.41,59.03 v50.6,59.84
PB6/D1/USART1_TX  (via drill 0.4)
  Top 0.203: U1.136 61.29,53.75 61.06,53.98 61.06,54.86 v60.76,55.17
  Top 1.016: CON3.2 U4.D1
  Bottom 0.203: v60.76,55.17 60.76,55.68 62.69,57.61 62.69,59.94 63.7,60.96 77.22,60.96 80.26,64.01
  Bottom 1.016: 80.26,64.01 CON3.2
PB8/I2C1_SCL  (via drill 0.4)
  Top 0.203: U1.139 59.79,52.3 60.38,51.71 61.24,51.71 61.65,51.31 61.82,51.31 63.09,50.04 63.09,47.07 66.34,43.81 66.34,40.01 67.77,38.58 67.77,37.31 70.23,34.85 71.04,34.85 73.48,32.41 75.18,32.41 76.49,31.1 84.93,31.1 v85.55,30.48 | 89.84,29.21 89.38,29.21 R17.1
  Top 1.016: UEXT.5 89.84,29.21
  Bottom 0.203: v85.55,30.48 86.82,29.21 89.86,29.21
  Bottom 1.016: 89.86,29.21 UEXT.5
PB9/I2C1_SDA  (via drill 0.4)
  Top 0.203: U1.140 59.29,52.24 60.22,51.31 60.98,51.31 61.39,50.9 61.67,50.9 62.69,49.89 62.69,46.91 65.94,43.66 65.94,39.85 67.36,38.43 67.36,37.16 70.08,34.44 70.89,34.44 73.33,32 74.98,32 76.29,30.69 84.32,30.69 v85.55,29.46 | R18.1 89.13,27.94 92.08,27.94 92.48,28.35
  Top 1.016: UEXT.6 92.48,28.35
  Bottom 0.203: v85.55,29.46 87.07,27.94 92.08,27.94 92.48,28.35
  Bottom 1.016: 92.48,28.35 UEXT.6
PB10/SPI2_SCK/UART3_TX  (via drill 0.4)
  Top 0.203: U1.69 73.29,26.35 74.75,24.89 87.07,24.89 v87.99,25.81
  Top 0.254: 90.81,23.16 90.81,17.48
  Top 1.016: UEXT.9 90.81,23.16 | 90.81,17.48 BOOT.1
  Bottom 0.203: v87.99,25.81 89.66,24.13 90.19,24.13
  Bottom 1.016: 90.19,24.13 UEXT.9
PB12/OTG2_HS_ID  (via drill 0.4)
  Top 0.203: USB_OTG2.ID 7.09,27.23 v10.54,27.23 | v67.46,42.88 67.46,42.37 67.16,42.06 67.16,40.31 68.58,38.89 68.58,37.62 70.54,35.66 71.35,35.66 73.72,33.29 U1.73 | D3.2 14.21,31.9 v17.68,31.9
  Top 0.254: D3.2 12.97,32.09 v12.88,32
  Bottom 0.203: v67.46,42.88 66.75,42.88 66.04,42.16 53.85,42.16 50.7,39.01 40.87,39.01 39.95,38.1 24.31,38.1 18.11,31.9 v17.68,31.9 | v12.88,32 13.56,31.32 13.56,30.15 13.08,29.67 12.6,29.67 10.54,27.61 v10.54,27.23
PB13/OTG_HS_VBUS  (via drill 0.4)
  Top 0.203: U1.74 73.78,33.79 71.5,36.07 70.69,36.07 68.99,37.77 68.99,39.04 67.56,40.46 67.56,41.45 v67.87,41.76 | R40.1 12.37,31.29 16.87,31.29 v16.97,31.19
  Bottom 0.203: v67.87,41.76 68.28,42.16 68.28,43.08 67.77,43.59 66.85,43.59 65.84,42.57 53.7,42.57 50.55,39.42 40.72,39.42 39.8,38.51 24.16,38.51 18.26,32.61 17.37,32.61 16.97,32.21 v16.97,31.19